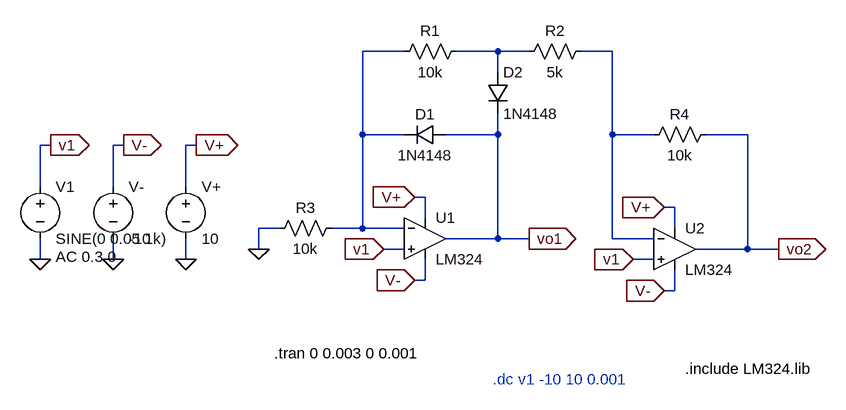
[diagram p0: schematic TP1_C3.asc]
TP1_C3.asc, the LTspice schematic file:
Version 4.1
SHEET 1 1572 680
WIRE 896 144 832 144
WIRE 1040 144 976 144
WIRE 1088 144 1040 144
WIRE 1216 144 1168 144
WIRE 1040 176 1040 144
WIRE 832 272 832 144
WIRE 896 272 832 272
WIRE 1040 272 1040 240
WIRE 1040 272 960 272
WIRE 1216 272 1216 144
WIRE 1280 272 1216 272
WIRE 1424 272 1360 272
WIRE 352 288 336 288
WIRE 464 288 448 288
WIRE 576 288 560 288
WIRE 336 352 336 288
WIRE 448 352 448 288
WIRE 560 352 560 288
WIRE 928 368 912 368
WIRE 1312 384 1296 384
WIRE 928 400 928 368
WIRE 704 416 672 416
WIRE 832 416 832 272
WIRE 832 416 784 416
WIRE 896 416 832 416
WIRE 1312 416 1312 384
WIRE 1040 432 1040 272
WIRE 1040 432 960 432
WIRE 1088 432 1040 432
WIRE 1216 432 1216 272
WIRE 1280 432 1216 432
WIRE 672 448 672 416
WIRE 896 448 864 448
WIRE 1424 448 1424 272
WIRE 1424 448 1344 448
WIRE 1472 448 1424 448
WIRE 336 464 336 432
WIRE 448 464 448 432
WIRE 560 464 560 432
WIRE 1280 464 1248 464
WIRE 928 496 928 464
WIRE 928 496 912 496
WIRE 1312 512 1312 480
WIRE 1312 512 1296 512
FLAG 672 448 0
FLAG 1088 432 vo1
IOPIN 1088 432 Out
FLAG 1472 448 vo2
IOPIN 1472 448 Out
FLAG 864 448 v1
IOPIN 864 448 In
FLAG 1248 464 v1
IOPIN 1248 464 In
FLAG 912 368 V+
IOPIN 912 368 In
FLAG 1296 384 V+
IOPIN 1296 384 In
FLAG 912 496 V-
IOPIN 912 496 In
FLAG 1296 512 V-
IOPIN 1296 512 In
FLAG 576 288 V+
IOPIN 576 288 Out
FLAG 560 464 0
FLAG 464 288 V-
IOPIN 464 288 Out
FLAG 448 464 0
FLAG 352 288 v1
IOPIN 352 288 Out
FLAG 336 464 0
SYMBOL OpAmps\\opamp2 928 368 R0
SYMATTR InstName U1
SYMATTR Value LM324
SYMBOL OpAmps\\opamp2 1312 384 R0
SYMATTR InstName U2
SYMATTR Value LM324
SYMBOL res 992 128 R90
WINDOW 0 0 56 VBottom 2
WINDOW 3 32 56 VTop 2
SYMATTR InstName R1
SYMATTR Value 10k
SYMATTR SpiceLine tol=1
SYMBOL res 1376 256 R90
WINDOW 0 0 56 VBottom 2
WINDOW 3 32 56 VTop 2
SYMATTR InstName R4
SYMATTR Value 10k
SYMATTR SpiceLine tol=1
SYMBOL res 800 400 R90
WINDOW 0 0 56 VBottom 2
WINDOW 3 32 56 VTop 2
SYMATTR InstName R3
SYMATTR Value 10k
SYMATTR SpiceLine tol=1
SYMBOL voltage 560 336 R0
WINDOW 123 0 0 Left 0
WINDOW 39 0 0 Left 0
SYMATTR InstName V+
SYMATTR Value 10
SYMBOL voltage 448 336 R0
WINDOW 123 0 0 Left 0
WINDOW 39 0 0 Left 0
SYMATTR InstName V-
SYMATTR Value -10
SYMBOL voltage 336 336 R0
WINDOW 123 24 124 Left 2
WINDOW 39 0 0 Left 0
SYMATTR InstName V1
SYMATTR Value SINE(0 0.05 1k)
SYMATTR Value2 AC 0.3 0
SYMBOL diode 960 256 R90
WINDOW 0 0 32 VBottom 2
WINDOW 3 32 32 VTop 2
SYMATTR InstName D1
SYMATTR Value 1N4148
SYMBOL diode 1024 176 R0
SYMATTR InstName D2
SYMATTR Value 1N4148
SYMBOL res 1184 128 R90
WINDOW 0 0 56 VBottom 2
WINDOW 3 32 56 VTop 2
SYMATTR InstName R2
SYMATTR Value 5k
SYMATTR SpiceLine tol=1
TEXT 1328 632 Left 2 !.include LM324.lib
TEXT 1032 648 Left 2 ;.dc v1 -10 10 0.001
TEXT 696 608 Left 2 !.tran 0 0.003 0 0.001

The netlist it stands for:
* TP1_C3.asc
X§U1 v1 N001 V+ V- vo1 LM324  ; pins In+ In- V+ V- OUT
X§U2 v1 N003 V+ V- vo2 LM324  ; pins In+ In- V+ V- OUT
R1 N002 N001 10k tol=1
R4 vo2 N003 10k tol=1
R3 N001 0 10k tol=1
V+ V+ 0 10
V- V- 0 -10
V1 v1 0 SINE(0 0.05 1k) AC 0.3 0
D1 vo1 N001 1N4148
D2 N002 vo1 1N4148
R2 N003 N002 5k tol=1
.model D D
.lib standard.dio
.include LM324.lib
* .dc v1 -10 10 0.001
.tran 0 0.003 0 0.001
.backanno
.end